# EAGLE design Hello_World (EAGLE 6.6.0)
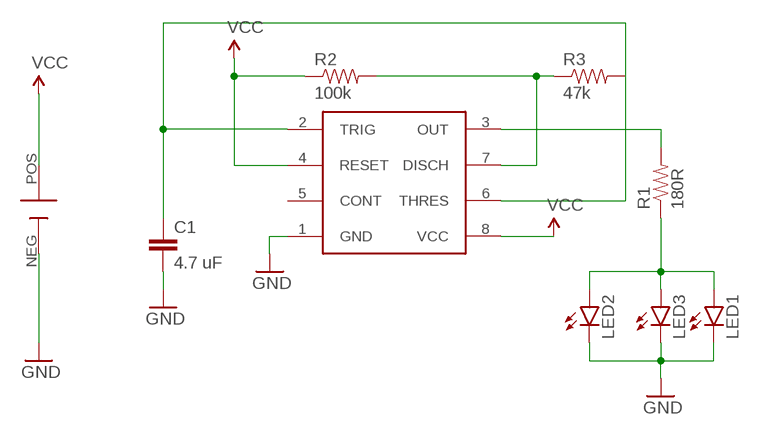
[diagram p0: schematic, sheet 1]

## Parts
C1  4.7 uF  C-EUC1206  [C1206]
LED1  LED1206  [LED-1206]
LED2  LED1206  [LED-1206]
LED3  LED1206  [LED-1206]
R1  180R  RESISTOR1206  [1206]
R2  100k  RESISTOR1206  [1206]
R3  47k  RESISTOR1206  [1206]
U1  NE555PSR  [PS_R-PDSO-G8]
U$1  SMD_BATTERY_9V  [SMD_BATTERY_PADS]

## Nets
GND: C1.2 LED1.C LED2.C LED3.C U1.1(GND) U$1.NEG
N$2: LED1.A LED2.A LED3.A R1.1
N$4: R2.2 R3.1 U1.7(DISCH)
N$5: R1.2 U1.3(OUT)
N$7: C1.1 R3.2 U1.2(TRIG) U1.6(THRES)
VCC: R2.1 U1.4(RESET) U1.8(VCC) U$1.POS
Unconnected: U1.5(CONT)

## Library data of the parts
C1 = resistor:C-EU: CAPACITOR, European symbol
LED1-LED3 = SparkFun-LED:LED: LEDs Standard schematic elements and footprints for 5mm, 3mm, 1206, and 0603 sized LEDs. 5mm - Spark Fun Electronics SKU : COM-00529 (and others)
R1-R3 = SparkFun-Resistors:RESISTOR: Resistor Basic schematic elements and footprints for 0603, 1206, and PTH resistors.
U1 = texas-sn55-sn75:NE555PSR
U$1 = test:SMD_BATTERY_9V

## Board
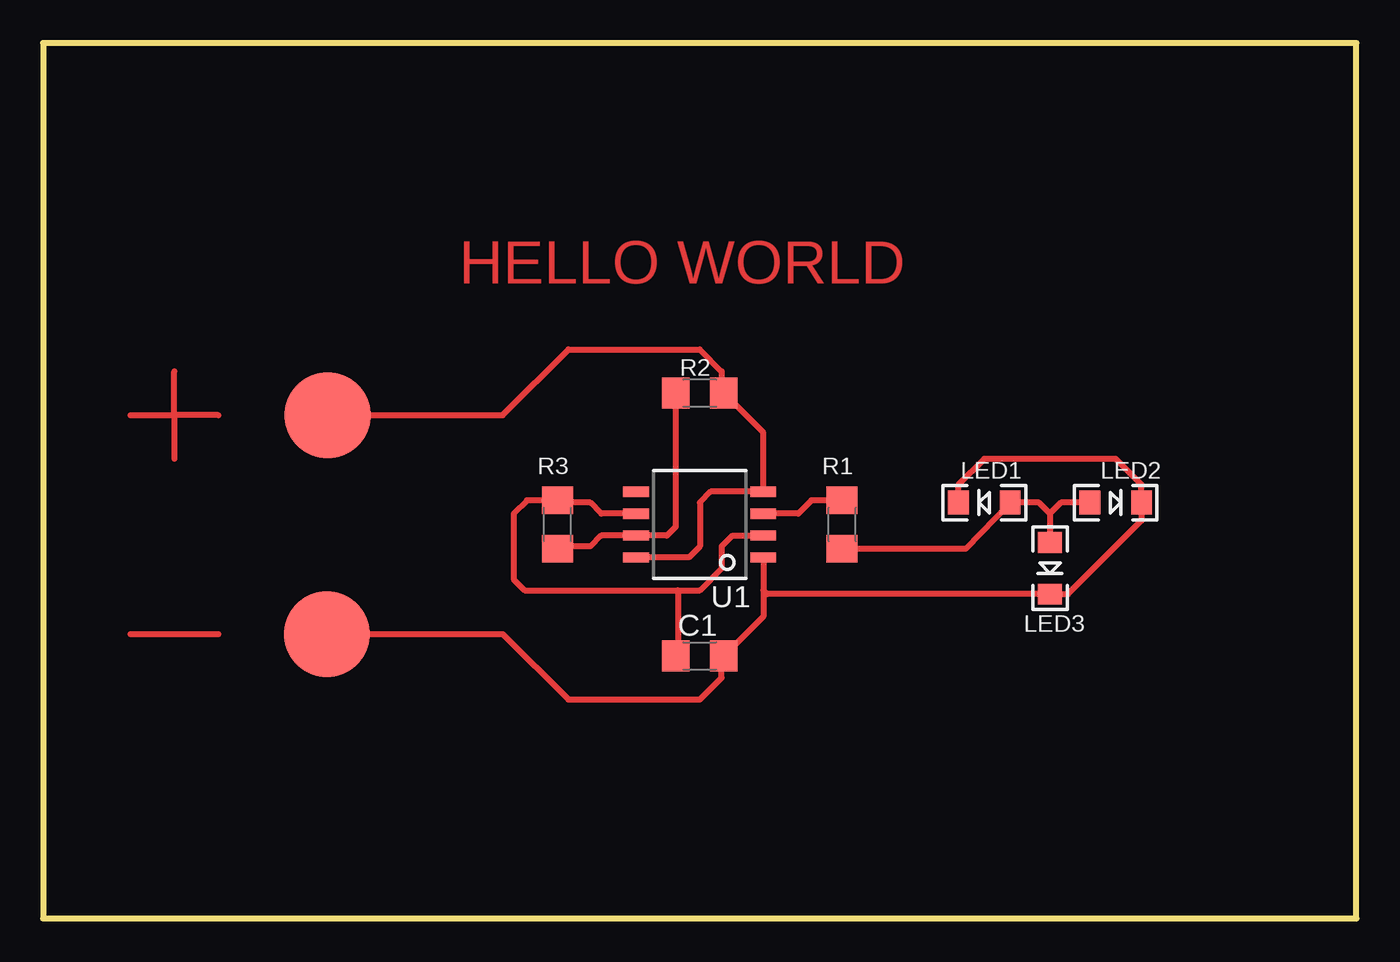
[diagram p1: board, top side]

Size 76.2 x 50.8 mm. Coordinates in mm from the lower left corner, seen from the top.
Outline: 0,0 76.2,0 76.2,50.8 0,50.8 0,0
Copper layers (1*16): Top 0.035mm / dielectric 1.5mm / Bottom 0.035mm
Design rules "default": minimum track width 10mil, minimum drill 24mil, track to track 8mil, track to pad 8mil, pad to pad 8mil, via to via 8mil, smd to smd 8mil, copper to edge 40mil, drill to drill 8mil, minimum pad ring 10mil, minimum via ring 8mil, stop-mask expansion 4mil, vias tented up to drill 0mil, thermal gap 10mil

### Footprints (pad centres in the part's own frame; a part is rotated, then mirrored left to right if it is on the bottom)
C1206 = smd 1.6 x 1.8: 1 -1.4,0; 2 1.4,0
LED-1206 = smd 1.2 x 1.4: A -1.5,0; C 1.5,0
1206 = smd 1.6 x 1.8: 1 -1.4,0; 2 1.4,0
PS_R-PDSO-G8 = smd 0.6 x 1.5: 1 -1.905,-3.685; 2 -0.635,-3.685; 3 0.635,-3.685; 4 1.905,-3.685; 5 1.905,3.7; 6 0.635,3.7; 7 -0.635,3.7; 8 -1.905,3.7
SMD_BATTERY_PADS = smd 5 x 5: NEG 6.35,-0.04; POS -6.35,0

### Placement (x,y rotation side)
C1  38.1,15.24 0 top
LED1  54.61,24.13 180 top
LED2  62.23,24.13 0 top
LED3  58.42,20.32 270 top
R1  46.35,22.86 90 top
R2  38.1,30.48 180 top
R3  29.84,22.86 90 top
U1  38.1,22.86 90 top
U$1  16.51,22.86 270 top

### Tracks (layer width: path | path; a pad name or v marks a point on that pad's centre or on a via)
GND
  Top 0.356: U1.1 41.78,19.05 | 41.78,19.05 41.78,17.52 C1.2 39.37,15.11 39.37,13.97 38.1,12.7 30.48,12.7 26.67,16.51 U$1.NEG | LED1.C 53.11,25.17 54.61,26.67 62.23,26.67 63.73,25.17 LED2.C 63.73,23.09 59.46,18.82 LED3.C 42.02,18.82 41.78,19.05
N$1
  Top 0.356: 10.16,29.21 7.62,29.21 | 5.08,29.21 7.62,29.21 | 7.62,29.21 7.62,31.75 | 7.62,29.21 7.62,26.67
N$2
  Top 0.356: LED2.A 59.05,24.13 58.42,23.5 | 58.42,23.5 57.78,24.13 LED1.A 53.54,21.46 R1.1 | 58.42,23.5 LED3.A
N$3
  Top 0.356: 5.08,16.51 10.16,16.51
N$4
  Top 0.356: R2.2 36.7,22.73 36.2,22.23 U1.7 32.38,22.23 31.75,21.59 29.98,21.59 R3.1
N$5
  Top 0.356: R1.2 44.58,24.26 43.81,23.5 U1.3
N$7
  Top 0.356: U1.2 40.01,22.23 39.37,21.59 39.37,20.32 38.1,19.05 36.83,19.05 | 36.83,19.05 36.83,15.37 C1.1 | U1.6 32.38,23.5 31.75,24.13 29.98,24.13 R3.2 28.07,24.26 27.3,23.5 27.3,19.68 27.94,19.05 36.83,19.05
VCC
  Top 0.356: U1.8 37.47,20.95 38.1,21.59 38.1,24.13 38.73,24.77 U1.4 41.78,28.2 R2.1 39.37,30.61 39.37,31.75 38.1,33.02 30.48,33.02 26.67,29.21 U$1.POS

### Text on the board
Top: HELLO WORLD